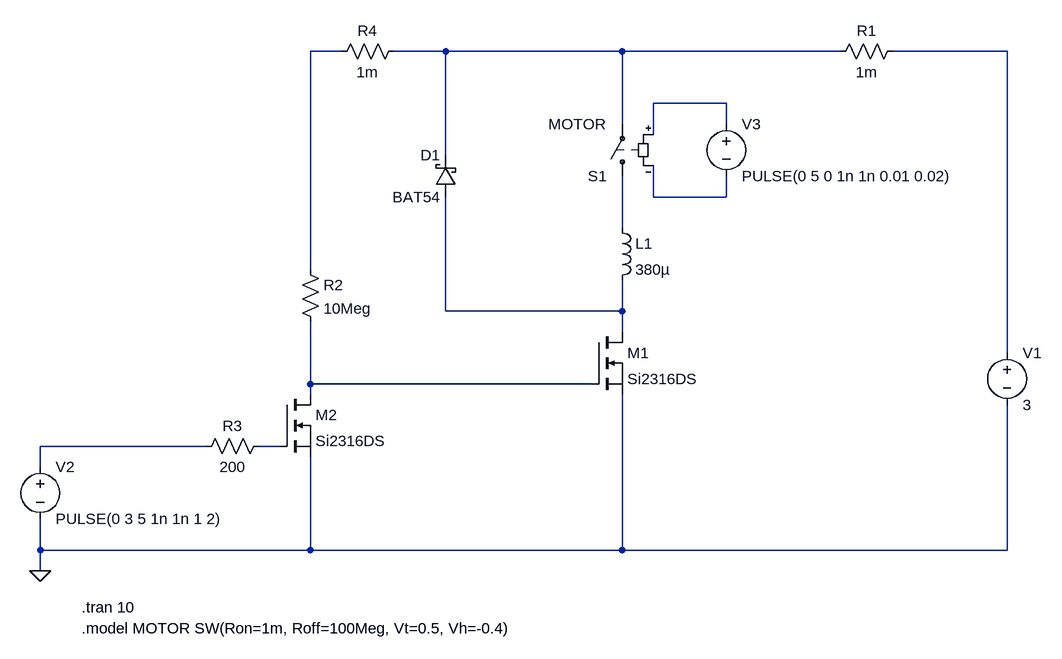
[diagram p0: schematic Motor scheme.asc]
Motor scheme.asc, the LTspice schematic file:
Version 4
SHEET 1 1336 680
WIRE 96 -320 48 -320
WIRE 256 -320 176 -320
WIRE 528 -320 256 -320
WIRE 864 -320 528 -320
WIRE 1120 -320 944 -320
WIRE 688 -240 576 -240
WIRE 528 -208 528 -320
WIRE 688 -208 688 -240
WIRE 576 -192 576 -240
WIRE 256 -160 256 -320
WIRE 576 -96 576 -144
WIRE 688 -96 688 -128
WIRE 688 -96 576 -96
WIRE 528 -48 528 -128
WIRE 48 16 48 -320
WIRE 256 80 256 -96
WIRE 528 80 528 32
WIRE 528 80 256 80
WIRE 528 112 528 80
WIRE 1120 144 1120 -320
WIRE 48 192 48 96
WIRE 480 192 48 192
WIRE 48 208 48 192
WIRE -112 288 -368 288
WIRE 0 288 -32 288
WIRE -368 320 -368 288
WIRE -368 448 -368 400
WIRE 48 448 48 304
WIRE 48 448 -368 448
WIRE 528 448 528 208
WIRE 528 448 48 448
WIRE 1120 448 1120 224
WIRE 1120 448 528 448
WIRE -368 480 -368 448
FLAG -368 480 0
SYMBOL nmos 480 112 R0
SYMATTR InstName M1
SYMATTR Value Si2316DS
SYMBOL res 32 0 R0
SYMATTR InstName R2
SYMATTR Value 10Meg
SYMBOL voltage 1120 128 R0
WINDOW 123 0 0 Left 0
WINDOW 39 0 0 Left 0
SYMATTR InstName V1
SYMATTR Value 3
SYMBOL res -128 304 R270
WINDOW 0 32 56 VTop 2
WINDOW 3 0 56 VBottom 2
SYMATTR InstName R3
SYMATTR Value 200
SYMBOL voltage -368 304 R0
WINDOW 123 0 0 Left 0
WINDOW 39 0 0 Left 0
SYMATTR InstName V2
SYMATTR Value PULSE(0 3 5 1n 1n 1 2)
SYMBOL nmos 0 208 R0
SYMATTR InstName M2
SYMATTR Value Si2316DS
SYMBOL ind 512 -64 R0
SYMATTR InstName L1
SYMATTR Value 380µ
SYMATTR SpiceLine Rser=30
SYMBOL sw 528 -112 R180
SYMATTR InstName S1
SYMATTR Value MOTOR
SYMBOL voltage 688 -224 R0
WINDOW 123 0 0 Left 0
WINDOW 39 0 0 Left 0
SYMATTR InstName V3
SYMATTR Value PULSE(0 5 0 1n 1n 0.01 0.02)
SYMBOL schottky 272 -96 R180
WINDOW 0 24 64 Left 2
WINDOW 3 24 0 Left 2
SYMATTR InstName D1
SYMATTR Value BAT54
SYMATTR Description Diode
SYMATTR Type diode
SYMBOL res 848 -304 R270
WINDOW 0 32 56 VTop 2
WINDOW 3 0 56 VBottom 2
SYMATTR InstName R1
SYMATTR Value 1m
SYMBOL res 80 -304 R270
WINDOW 0 32 56 VTop 2
WINDOW 3 0 56 VBottom 2
SYMATTR InstName R4
SYMATTR Value 1m
TEXT -304 536 Left 2 !.tran 10
TEXT -304 568 Left 2 !.model MOTOR SW(Ron=1m, Roff=100Meg, Vt=0.5, Vh=-0.4)

The netlist it stands for:
* Motor scheme.asc
M1 N007 N008 0 0 Si2316DS
R2 N001 N008 10Meg
V1 N003 0 3
R3 N009 N010 200
V2 N009 0 PULSE(0 3 5 1n 1n 1 2)
M2 N008 N010 0 0 Si2316DS
L1 N006 N007 380µ Rser=30
S1 N006 N002 N004 N005 MOTOR
V3 N004 N005 PULSE(0 5 0 1n 1n 0.01 0.02)
D1 N007 N002 BAT54
R1 N002 N003 1m
R4 N001 N002 1m
.model D D
.lib standard.dio
.model NMOS NMOS
.model PMOS PMOS
.lib standard.mos
.tran 10
.model MOTOR SW(Ron=1m, Roff=100Meg, Vt=0.5, Vh=-0.4)
.backanno
.end